# EAGLE schematic Reciever Schematic (EAGLE 9.6.2)
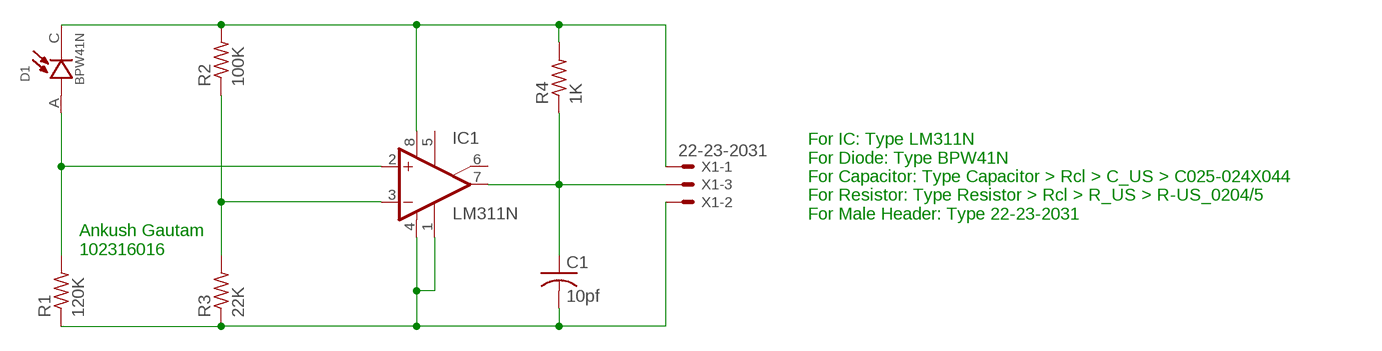
[diagram p0: schematic, sheet 1]

## Parts
C1  10pf  C-US025-025X050  [C025-025X050]
D1  BPW41N  [DIO_BPW41N]
IC1  LM311N  [DIL08]
R1  120K  R-US_0204/5  [0204/5]
R2  100K  R-US_0204/5  [0204/5]
R3  22K  R-US_0204/5  [0204/5]
R4  1K  R-US_0204/5  [0204/5]
X1  22-23-2031  [22-23-2031]

## Nets
N$1: D1.A IC1.2(+IN) R1.2
N$2: C1.2 IC1.1(GND) IC1.4(V-) R1.1 R3.1 X1.2
N$3: D1.C IC1.8(V+) R2.2 R4.2 X1.1
N$4: IC1.3(-IN) R2.1 R3.2
N$5: C1.1 IC1.7(OUT) R4.1 X1.3
Unconnected: IC1.5(ON) IC1.6(ON/STR)

## Notes on the sheet
- For IC: Type LM311N
  For Diode: Type BPW41N
  For Capacitor: Type Capacitor > Rcl > C_US > C025-024X044
  For Resistor: Type Resistor > Rcl > R_US > R-US_0204/5
  For Male Header: Type 22-23-2031
- Ankush Gautam
  102316016

## Library data of the parts
C1 = rcl:C-US: CAPACITOR, American symbol; SPICEPREFIX: C
D1 = BPW41N:BPW41N: BPW41N Series 65° Side View 950 nm PIN Photodiode Check availability <https://pricing.snapeda.com/parts/BPW41N/Vishay%20Semiconductor%20Opto%20Division/view-part?ref=eda>; AVAILABILITY: In Stock; DESCRIPTION: Photodiode 940nm 130° Radial, Side View; MF: Vishay Semiconductor Opto Division; MP: BPW41N; PACKAGE: None; PRICE: None; PURCHASE-URL: https://pricing.snapeda.com/search/part/BPW41N/?ref=eda
IC1 = linear:LM311: COMPARATOR
R1-R4 = rcl:R-US_: RESISTOR, American symbol; SPICEPREFIX: R
X1 = con-molex:22-23-2031: .100" (2.54mm) Center Header - 3 Pin; MF: MOLEX; MPN: 22-23-2031; OC_FARNELL: 1462950; OC_NEWARK: 30C0862